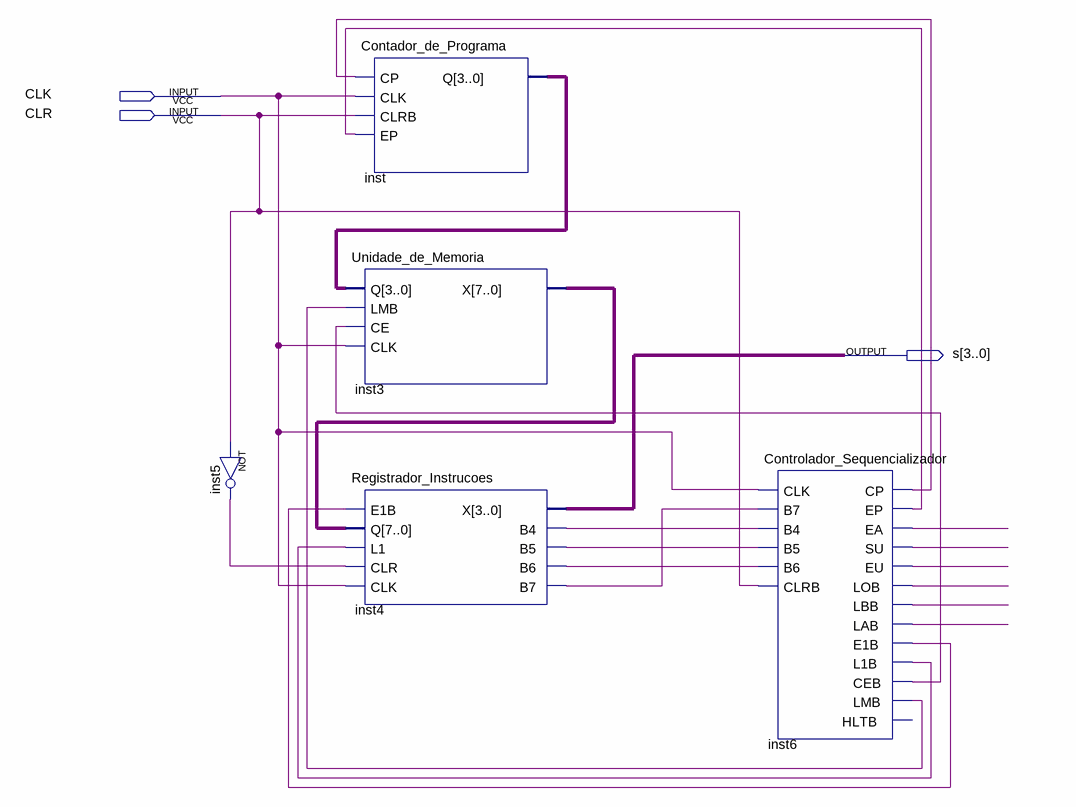
[diagram p0: schematic sheet]
// Quartus schematic test.bdf as structural Verilog: 5 symbols, 3 pins
module test (
  input  CLK,
  input  CLR,
  output [3:0] s
);

  wire inst4_b4, inst4_b5, inst4_b6, inst4_b7, inst5_out, inst6_ceb, inst6_cp, inst6_e1b, inst6_ea, inst6_ep,
       inst6_eu, inst6_l1b, inst6_lab, inst6_lbb, inst6_lmb, inst6_lob, inst6_su;
  wire [3:0] inst_q;
  wire [7:0] inst3_x;

  not inst5 (inst5_out, CLR);
  Contador_de_Programa inst (.CP(inst6_cp), .CLK(CLK), .CLRB(CLR), .EP(inst6_ep), .Q(inst_q));
  Unidade_de_Memoria inst3 (.Q(inst_q), .LMB(inst6_lmb), .CE(inst6_ceb), .CLK(CLK), .X(inst3_x));
  Registrador_Instrucoes inst4 (
    .E1B(inst6_e1b), .Q(inst3_x), .L1(inst6_l1b), .CLR(inst5_out), .CLK(CLK), .X(s), .B4(inst4_b4),
    .B5(inst4_b5), .B6(inst4_b6), .B7(inst4_b7));
  Controlador_Sequencializador inst6 (
    .CLK(CLK), .B7(inst4_b7), .B4(inst4_b4), .B5(inst4_b5), .B6(inst4_b6), .CLRB(CLR), .CP(inst6_cp),
    .EP(inst6_ep), .EA(inst6_ea), .SU(inst6_su), .EU(inst6_eu), .LOB(inst6_lob), .LBB(inst6_lbb),
    .LAB(inst6_lab), .E1B(inst6_e1b), .L1B(inst6_l1b), .CEB(inst6_ceb), .LMB(inst6_lmb));  // open: HLTB
endmodule
